# EAGLE schematic BC40M_nrf53 (EAGLE 9.6.2)

## Sheet 1 of 3
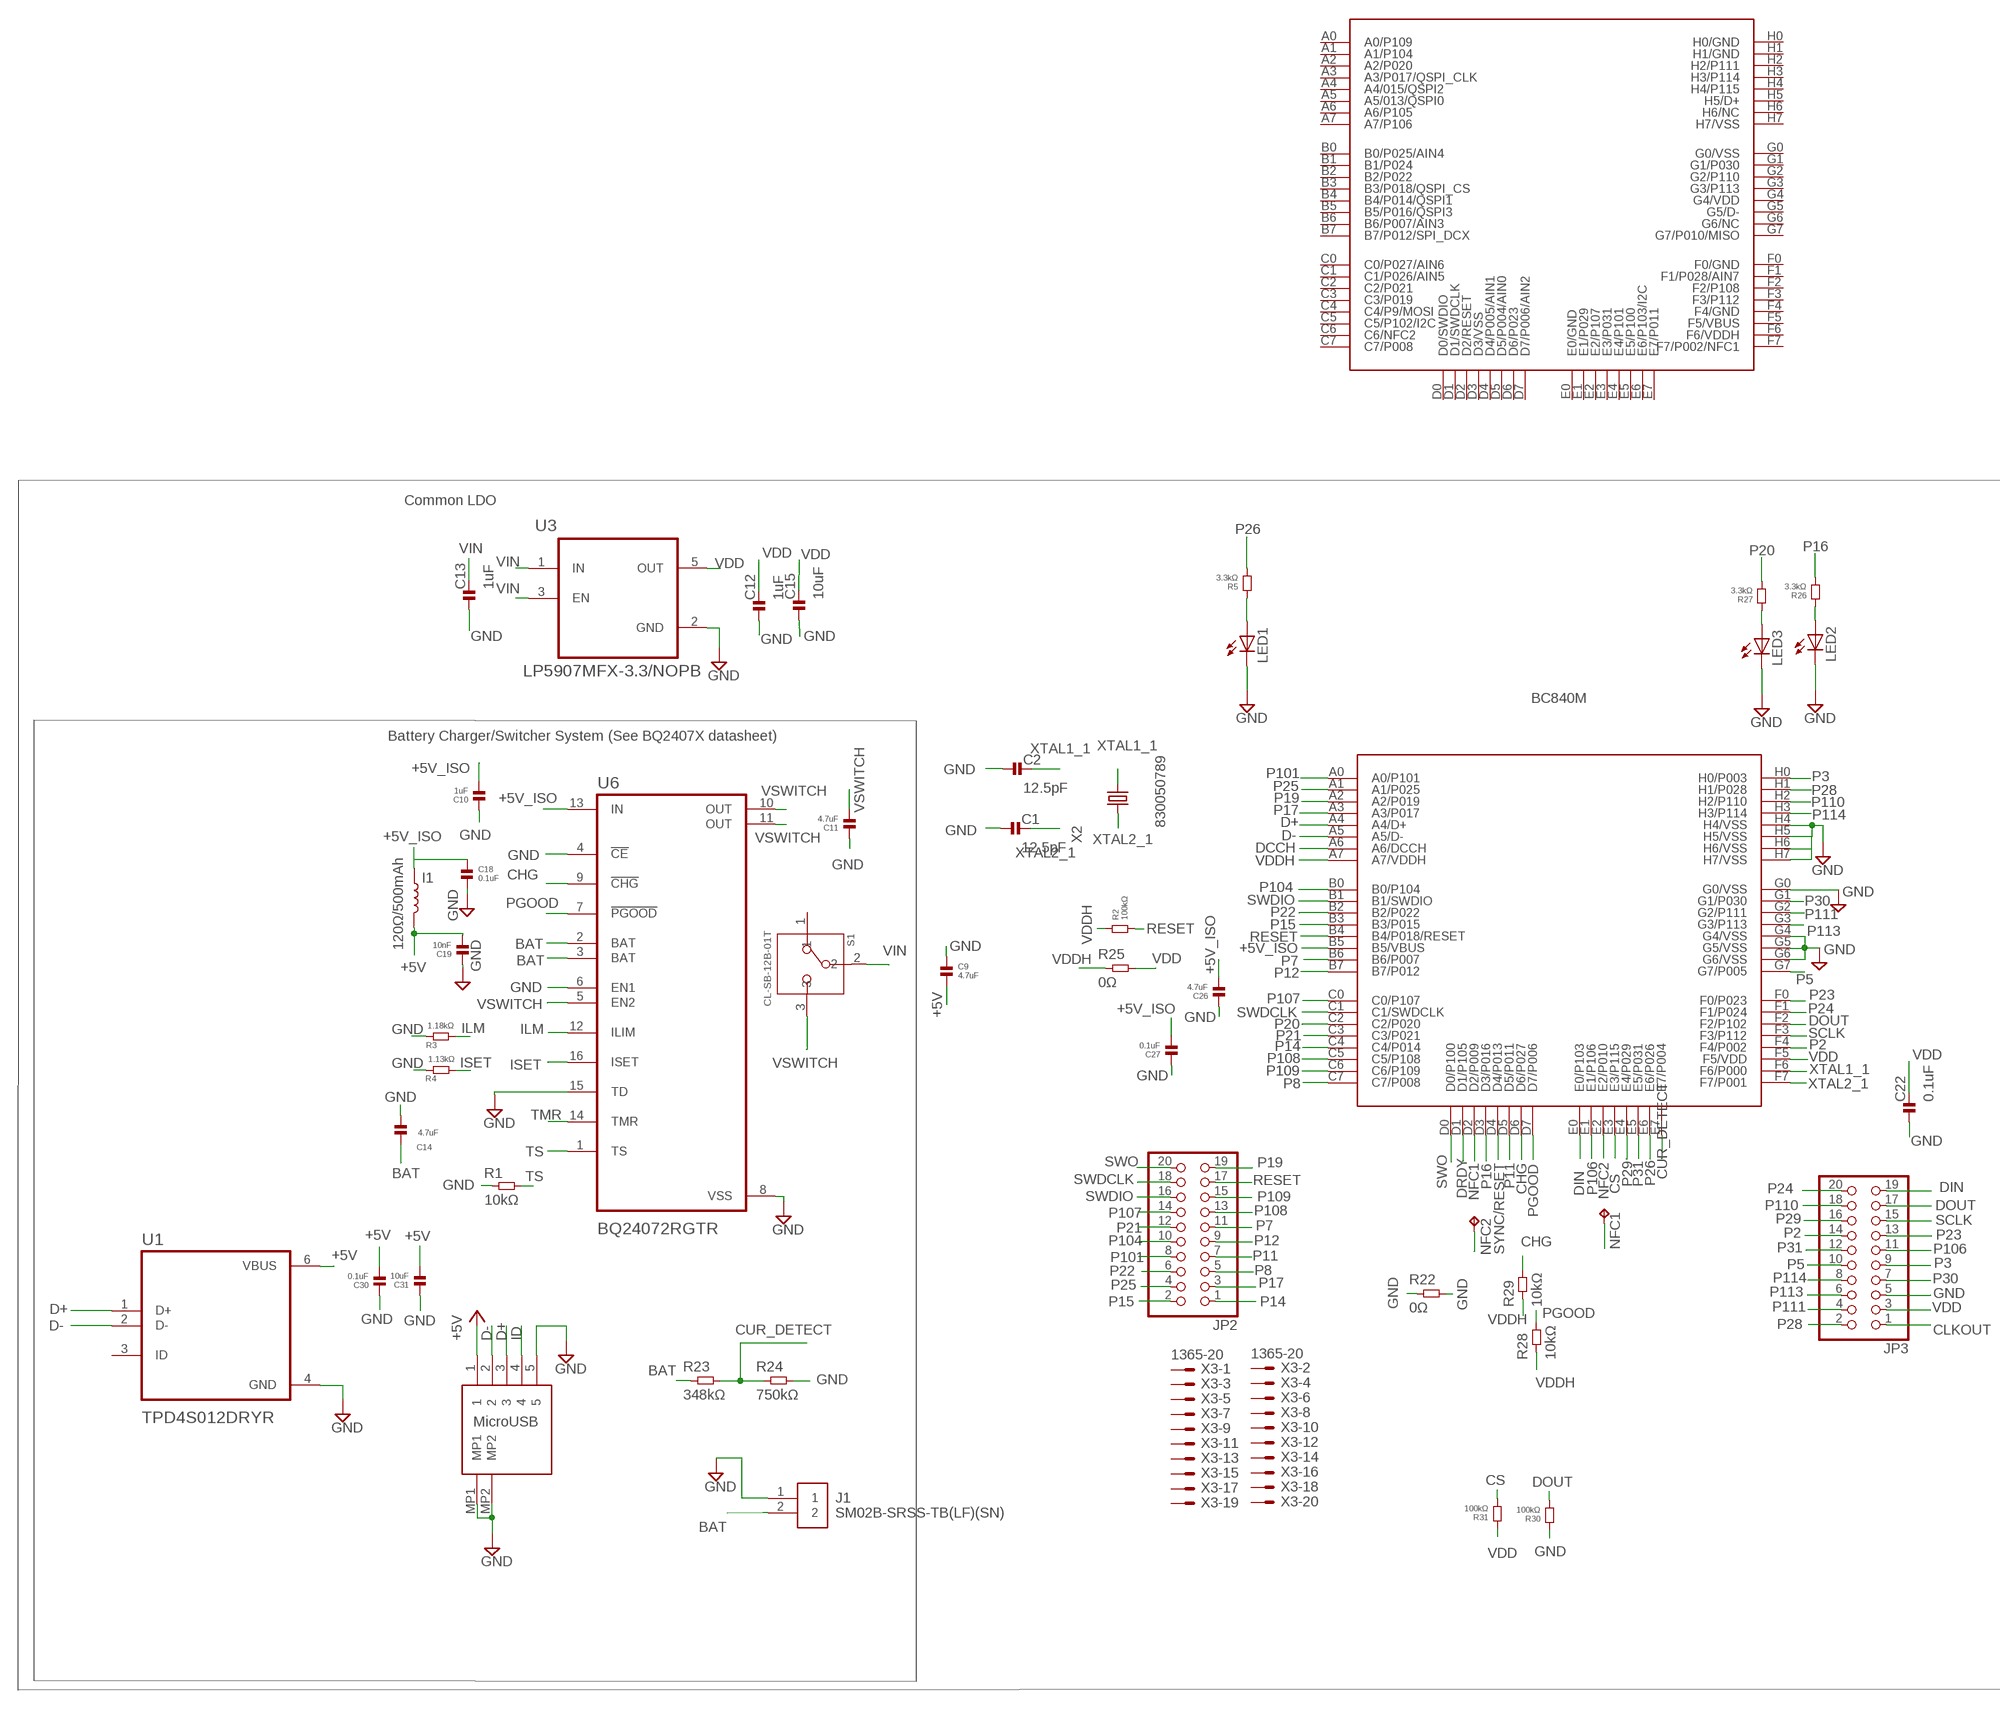
[diagram p0: schematic, sheet 1, part 1 of 2]
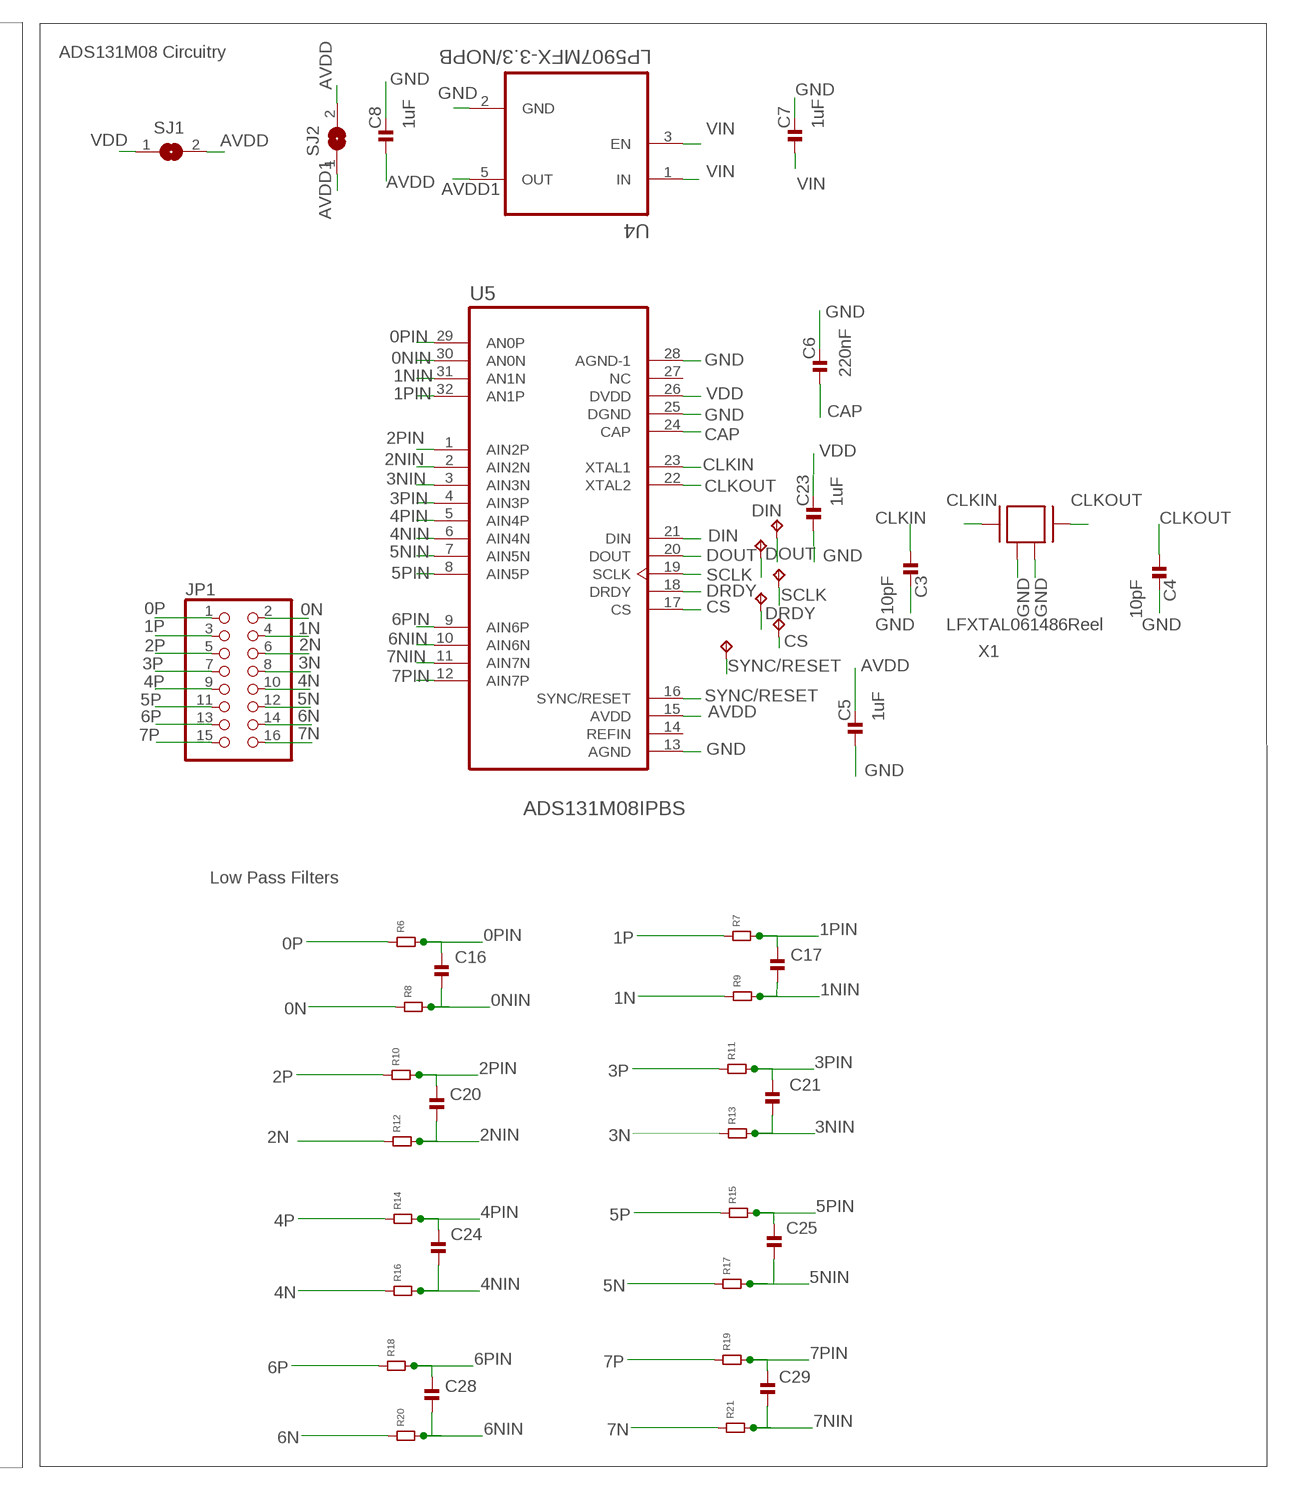
[diagram p1: schematic, sheet 1, part 2 of 2]

### Parts
C1  12.5pF  CAPACITOR.0201  [0201]
C2  12.5pF  CAPACITOR.0201  [0201]
C3  10pF  CAPACITOR.0201  [0201]
C4  10pF  CAPACITOR.0201  [0201]
C5  1uF  CAPACITOR.0201  [0201]
C6  220nF  CAPACITOR.0201  [0201]
C7  1uF  CAPACITOR.0201  [0201]
C8  1uF  CAPACITOR.0201  [0201]
C9  4.7uF  CAPACITOR.0201  [0201]
C10  1uF  CAPACITOR.0201  [0201]
C11  4.7uF  CAPACITOR.0201  [0201]
C12  1uF  CAPACITOR.0201  [0201]
C13  1uF  CAPACITOR.0201  [0201]
C14  4.7uF  CAPACITOR.0201  [0201]
C15  10uF  CAPACITOR.0402  [0402]
C16  100pF  CAPACITOR.0603  [0603]
C17  100pF  CAPACITOR.0603  [0603]
C18  0.1uF  CAPACITOR.0201  [0201]
C19  10nF  CAPACITOR.0201  [0201]
C20  100pF  CAPACITOR.0603  [0603]
C21  100pF  CAPACITOR.0603  [0603]
C22  0.1uF  CAPACITOR.0201  [0201]
C23  1uF  CAPACITOR.0201  [0201]
C24  100pF  CAPACITOR.0603  [0603]
C25  100pF  CAPACITOR.0603  [0603]
C26  4.7uF  CAPACITOR.0201  [0201]
C27  0.1uF  CAPACITOR.0201  [0201]
C28  100pF  CAPACITOR.0603  [0603]
C29  100pF  CAPACITOR.0603  [0603]
C30  0.1uF  CAPACITOR.0201  [0201]
C31  10uF  CAPACITOR.0402  [0402]
CS  TPTP07R  [TP07R]
DIN  TPTP07R  [TP07R]
DOUT  TPTP07R  [TP07R]
DRDY  TPTP07R  [TP07R]
I1  120Ω/500mAh  12NH-0402  [0402_COILCRAFT]
J1  SM02B-SRSS-TB(LF)(SN)  [SM02B-SRSS-TB(LF)(SN)]
JP1  PINHD-2X8SMT  [2X08_SMT]
JP2  PINHD-2X10SMT  [2X10_SMT]
JP3  PINHD-2X10SMT  [2X10_SMT]
LED1  LEDCHIPLED_0603  [CHIPLED_0603]
LED2  LEDCHIPLED_0603  [CHIPLED_0603]
LED3  LEDCHIPLED_0603  [CHIPLED_0603]
NFC1  TPTP14SQ  [TP14SQ]
NFC2  TPTP14SQ  [TP14SQ]
R1  10kΩ  RESISTOR.0201  [0201]
R2  100kΩ  RESISTOR.0201  [0201]
R3  1.18kΩ  RESISTOR.0603  [0603]
R4  1.13kΩ  RESISTOR.0603  [0603]
R5  3.3kΩ  RESISTOR.0201  [0201]
R6  1MOhm  RESISTOR.0603  [0603]
R7  1MOhm  RESISTOR.0603  [0603]
R8  1MOhm  RESISTOR.0603  [0603]
R9  1MOhm  RESISTOR.0603  [0603]
R10  1MOhm  RESISTOR.0603  [0603]
R11  1MOhm  RESISTOR.0603  [0603]
R12  1MOhm  RESISTOR.0603  [0603]
R13  1MOhm  RESISTOR.0603  [0603]
R14  1MOhm  RESISTOR.0603  [0603]
R15  1MOhm  RESISTOR.0603  [0603]
R16  1MOhm  RESISTOR.0603  [0603]
R17  1MOhm  RESISTOR.0603  [0603]
R18  1MOhm  RESISTOR.0603  [0603]
R19  1MOhm  RESISTOR.0603  [0603]
R20  1MOhm  RESISTOR.0603  [0603]
R21  1MOhm  RESISTOR.0603  [0603]
R22  0Ω  RESISTOR.0805  [0805]
R23  348kΩ  RESISTOR.0603  [0603]
R24  750kΩ  RESISTOR.0603  [0603]
R25  0Ω  RESISTOR.0805  [0805]
R26  3.3kΩ  RESISTOR.0201  [0201]
R27  3.3kΩ  RESISTOR.0201  [0201]
R28  10kΩ  RESISTOR.0402  [0402]
R29  10kΩ  RESISTOR.0402  [0402]
R30  100kΩ  RESISTOR.0402  [0402]
R31  100kΩ  RESISTOR.0402  [0402]
S1  CL-SB-12B-01T  [CL-SB-12B]
SCLK  TPTP07R  [TP07R]
SJ1  SJ  [SJ]
SJ2  SJ  [SJ]
SYNC  TPTP07R  [TP07R]
U1  TPD4S012DRYR  [PSON50P145X100X60-6N]
U2  BC840M  [BC840M]
U3  LP5907MFX-3.3/NOPB  [SOT95P280X145-5N]
U4  LP5907MFX-3.3/NOPB  [SOT95P280X145-5N]
U5  ADS131M08IPBS  [QFP50P700X700X120-32N]
U6  BQ24072RGTR  [QFN50P300X300X100-17N]
U7  DX4R005JJ2R1800  [DX4R005JJ2R1800]
U$1  BC40M  [BC40M]
X1  ABM3B-8.000MHZ-B2-T  [ABM3B-8.000MHZ-B2-T]
X2  FC-12M  [FC-12M]
X3  1365-20  [1365-20]

### Nets
0N: JP1.2 R8.1
0NIN: C16.2 R8.2 U5.30(AN0N)
0P: JP1.1 R6.1
0PIN: C16.1 R6.2 U5.29(AN0P)
1N: JP1.4 R9.1
1NIN: C17.2 R9.2 U5.31(AN1N)
1P: JP1.3 R7.1
1PIN: C17.1 R7.2 U5.32(AN1P)
2N: JP1.6 R12.1
2NIN: C20.2 R12.2 U5.2(AIN2N)
2P: JP1.5 R10.1
2PIN: C20.1 R10.2 U5.1(AIN2P)
3N: JP1.8 R13.1
3NIN: C21.2 R13.2 U5.3(AIN3N)
3P: JP1.7 R11.1
3PIN: C21.1 R11.2 U5.4(AIN3P)
4N: JP1.10 R16.1
4NIN: C24.2 R16.2 U5.6(AIN4N)
4P: JP1.9 R14.1
4PIN: C24.1 R14.2 U5.5(AIN4P)
5N: JP1.12 R17.1
5NIN: C25.2 R17.2 U5.7(AIN5N)
5P: JP1.11 R15.1
5PIN: C25.1 R15.2 U5.8(AIN5P)
6N: JP1.14 R20.1
6NIN: C28.2 R20.2 U5.10(AIN6N)
6P: JP1.13 R18.1
6PIN: C28.1 R18.2 U5.9(AIN6P)
7N: JP1.16 R21.1
7NIN: C29.2 R21.2 U5.11(AIN7N)
7P: JP1.15 R19.1
7PIN: C29.1 R19.2 U5.12(AIN7P)
+5V: C9.2 C19.2 C30.2 C31.2 I1.P$2 U1.6(VBUS) U7.1
+5V_ISO: C10.2 C18.1 C26.2 C27.2 I1.P$1 U2.B5(B5/VBUS) U6.13(IN)
AVDD: C5.2 C8.1 SJ1.2 SJ2.2 U5.15(AVDD)
AVDD1: SJ2.1 U4.5(OUT)
BAT: C14.2 J1.2 R23.1 U6.2(BAT) U6.3(BAT)
CAP: C6.1 U5.24(CAP)
CHG: R29.2 U2.D6(D6/P027) U6.9(!CHG)
CLKIN: C3.1 U5.23(XTAL1) X1.1
CLKOUT: C4.1 JP3.1 U5.22(XTAL2) X1.3
CS: CS.TP R31.1 U2.E3(E3/P115) U5.17(CS)
CUR_DETECT: R23.2 R24.1 U2.E7(E7/P004)
D+: U1.1(D+) U2.A4(A4/D+) U7.3
D-: U1.2(D-) U2.A5(A5/D-) U7.2
DCCH: U2.A6(A6/DCCH)
DIN: DIN.TP JP3.19 U2.E0(E0/P103) U5.21(DIN)
DOUT: DOUT.TP JP3.17 R30.1 U2.F2(F2/P102) U5.20(DOUT)
DRDY: DRDY.TP U2.D1(D1/P105) U5.18(DRDY)
GND: C1.1 C2.1 C3.2 C4.2 C5.1 C6.2 C7.2 C8.2 C9.1 C10.1 C11.1 C12.1 C13.1 C14.1 C15.1 C18.2 C19.1 C22.1 C23.1 C26.1 C27.1 C30.1 C31.1 J1.1 JP3.5 LED1.C LED2.C LED3.C R1.1 R3.1 R4.1 R22.1 R22.2 R24.2 R30.2 U1.4(GND) U2.G0(G0/VSS) U2.G4(G4/VSS) U2.G5(G5/VSS) U2.G6(G6/VSS) U2.H4(H4/VSS) U2.H5(H5/VSS) U2.H6(H6/VSS) U2.H7(H7/VSS) U3.2(GND) U4.2(GND) U5.13(AGND) U5.25(DGND) U5.28(AGND-1) U6.4(!CE) U6.6(EN1) U6.8(VSS) U6.15(TD) U7.5 U7.MP1 U7.MP2 X1.2 X1.4
ID: U7.4
ILM: R3.2 U6.12(ILIM)
ISET: R4.2 U6.16(ISET)
LED1: LED1.A R5.2
LED2: LED2.A R26.2
LED3: LED3.A R27.2
NFC1: NFC2.TP U2.D2(D2/P009)
NFC2: NFC1.TP U2.E2(E2/P010)
P2: JP3.14 U2.F4(F4/P002)
P3: JP3.9 U2.H0(H0/P003)
P5: JP3.10 U2.G7(G7/P005)
P7: JP2.11 U2.B6(B6/P007)
P8: JP2.5 U2.C7(C7/P008)
P11: JP2.7 U2.D5(D5/P011)
P12: JP2.9 U2.B7(B7/P012)
P14: JP2.1 U2.C4(C4/P014)
P15: JP2.2 U2.B3(B3/P015)
P16: R26.1 U2.D3(D3/P016)
P17: JP2.3 U2.A3(A3/P017)
P19: JP2.19 U2.A2(A2/P019)
P20: R27.1 U2.C2(C2/P020)
P21: JP2.12 U2.C3(C3/P021)
P22: JP2.6 U2.B2(B2/P022)
P23: JP3.13 U2.F0(F0/P023)
P24: JP3.20 U2.F1(F1/P024)
P25: JP2.4 U2.A1(A1/P025)
P26: R5.1 U2.E6(E6/P026)
P28: JP3.2 U2.H1(H1/P028)
P29: JP3.16 U2.E4(E4/P029)
P30: JP3.7 U2.G1(G1/P030)
P31: JP3.12 U2.E5(E5/P031)
P101: JP2.8 U2.A0(A0/P101)
P104: JP2.10 U2.B0(B0/P104)
P106: JP3.11 U2.E1(E1/P106)
P107: JP2.14 U2.C0(C0/P107)
P108: JP2.13 U2.C5(C5/P108)
P109: JP2.15 U2.C6(C6/P109)
P110: JP3.18 U2.H2(H2/P110)
P111: JP3.4 U2.G2(G2/P111)
P113: JP3.6 U2.G3(G3/P113)
P114: JP3.8 U2.H3(H3/P114)
PGOOD: R28.2 U2.D7(D7/P006) U6.7(!PGOOD)
RESET: JP2.17 R2.1 U2.B4(B4/P018/RESET)
SCLK: JP3.15 SCLK.TP U2.F3(F3/P112) U5.19(SCLK)
SWDCLK: JP2.18 U2.C1(C1/SWDCLK)
SWDIO: JP2.16 U2.B1(B1/SWDIO)
SWO: JP2.20 U2.D0(D0/P100)
SYNC/RESET: SYNC.TP U2.D4(D4/P013) U5.16(SYNC/RESET)
TMR: U6.14(TMR)
TS: R1.2 U6.1(TS)
VDD: C12.2 C15.2 C22.2 C23.2 JP3.3 R25.2 R31.2 SJ1.1 U2.F5(F5/VDD) U3.5(OUT) U5.26(DVDD)
VDDH: R2.2 R25.1 R28.1 R29.1 U2.A7(A7/VDDH)
VIN: C7.1 C13.2 S1.2 U3.1(IN) U3.3(EN) U4.1(IN) U4.3(EN)
VSWITCH: C11.2 S1.3 U6.5(EN2) U6.10(OUT) U6.11(OUT)
XTAL1_1: C2.2 U2.F6(F6/P000) X2.2
XTAL2_1: C1.2 U2.F7(F7/P001) X2.1
Unconnected: S1.1 U1.3(ID) U5.14(REFIN) U5.27(NC) U$1.A0(A0/P109) U$1.A1(A1/P104) U$1.A2(A2/P020) U$1.A3(A3/P017/QSPI_CLK) U$1.A4(A4/015/QSPI2) U$1.A5(A5/013/QSPI0) U$1.A6(A6/P105) U$1.A7(A7/P106) U$1.B0(B0/P025/AIN4) U$1.B1(B1/P024) U$1.B2(B2/P022) U$1.B3(B3/P018/QSPI_CS) U$1.B4(B4/P014/QSPI1) U$1.B5(B5/P016/QSPI3) U$1.B6(B6/P007/AIN3) U$1.B7(B7/P012/SPI_DCX) U$1.C0(C0/P027/AIN6) U$1.C1(C1/P026/AIN5) U$1.C2(C2/P021) U$1.C3(C3/P019) U$1.C4(C4/P9/MOSI) U$1.C5(C5/P102/I2C) U$1.C6(C6/NFC2) U$1.C7(C7/P008) U$1.D0(D0/SWDIO) U$1.D1(D1/SWDCLK) U$1.D2(D2/RESET) U$1.D3(D3/VSS) U$1.D4(D4/P005/AIN1) U$1.D5(D5/P004/AIN0) U$1.D6(D6/P023) U$1.D7(D7/P006/AIN2) U$1.E0(E0/GND) U$1.E1(E1/P029) U$1.E2(E2/P107) U$1.E3(E3/P031) U$1.E4(E4/P101) U$1.E5(E5/P100) U$1.E6(E6/P103/I2C) U$1.E7(E7/P011) U$1.F0(F0/GND) U$1.F1(F1/P028/AIN7) U$1.F2(F2/P108) U$1.F3(F3/P112) U$1.F4(F4/GND) U$1.F5(F5/VBUS) U$1.F6(F6/VDDH) U$1.F7(F7/P002/NFC1) U$1.G0(G0/VSS) U$1.G1(G1/P030) U$1.G2(G2/P110) U$1.G3(G3/P113) U$1.G4(G4/VDD) U$1.G5(G5/D-) U$1.G6(G6/NC) U$1.G7(G7/P010/MISO) U$1.H0(H0/GND) U$1.H1(H1/GND) U$1.H2(H2/P111) U$1.H3(H3/P114) U$1.H4(H4/P115) U$1.H5(H5/D+) U$1.H6(H6/NC) U$1.H7(H7/VSS) X3.1 X3.2 X3.3 X3.4 X3.5 X3.6 X3.7 X3.8 X3.9 X3.10 X3.11 X3.12 X3.13 X3.14 X3.15 X3.16 X3.17 X3.18 X3.19 X3.20

### Notes on the sheet
- Common LDO
- ADS131M08 Circuitry
- BC840M
- Battery Charger/Switcher System (See BQ2407X datasheet)
- 830050789
- LFXTAL061486Reel
- Low Pass Filters
- MicroUSB

## Sheet 2 of 3

## Sheet 3 of 3

## Library data of the parts
C1-C31 = standardparts:CAPACITOR
CS DIN DOUT DRDY NFC1 NFC2 SCLK SYNC = testpad:TP: Test pad
I1 = spkfncoils:12NH; MOUSER_PART: 994-0402HP-12NXGLU; PROD_ID: NDUC-15271; VALUE: 12nH
J1 = SM02B-SRSS-TB_LF__SN_:SM02B-SRSS-TB(LF)(SN): JST (JAPAN SOLDERLESS TERMINALS) - SM02B-SRSS-TB (LF)(SN) - HEADER, R/A, 2WAY Source: Datasheet <http://www.jst-mfg.com/product/pdf/eng/eSH.pdf> Check prices <https://pricing.snapeda.com/parts/SM02B-SRSS-TB%28LF%29%28SN%29/JST%20Sales/view-part?ref=eda>; AVAILABILITY: In Stock; DESCRIPTION: Connector Header Surface Mount, Right Angle 2 position 0.039 (1.00mm); MF: JST Sales; MP: SM02B-SRSS-TB(LF)(SN); PACKAGE: None; PRICE: None
JP1 = pinhead+:PINHD-2X8: PIN HEADER
JP2 JP3 = pinhead+:PINHD-2X10: PIN HEADER
LED1-LED3 = adafruit:LED: LED OSRAM: - CHIPLED LG R971, LG N971, LY N971, LG Q971, LY Q971, LO R971, LY R971 LH N974, LH R974 LS Q976, LO Q976, LY Q976 LO Q996 - Hyper CHIPLED LW Q18S LB Q993, LB Q99A, LB R99A - SideLED LS A670, LO A670, LY A670, LG A670, LP A670 LB A673, LV A673, LT A673, LW A673 LH A674 LY A675 LS A676, LA A676, LO A676, LY A676, LW A676 LS A679, LY A679, LG A679 - Hyper Micro SIDELED® LS Y876, LA Y876, LO Y876, LY Y876 LT Y87S - SmartLED LW L88C, LW L88S LB L89C, LB L89S, LG L890 LS L89K, LO L89K, LY L89K LS L896, LA L896, LO L896, LY L896 - TOPLED LS T670, LO T670, LY T670, LG T670, LP T670 LSG T670, LSP T670, LSY T670, LOP T670, LYG T670 LG T671, LOG T671, LSG T671 LB T673, LV T673, LT T673, LW T673 LH T674 LS T676, LA T676, LO T676, LY T676, LB T676, LH T676, LSB T676, LW T676 LB T67C, LV T67C, LT T67C, LS T67K, LO T67K, LY T67K, LW E67C LS E67B, LA E67B, LO E67B, LY E67B, LB E67C, LV E67C, LT E67C LW T67C LS T679, LY T679, LG T679 LS T770, LO T770, LY T770, LG T770, LP T770 LB T773, LV T773, LT T773, LW T773 LH T774 LS E675, LA E675, LY E675, LS T675 LS T776, LA T776, LO T776, LY T776, LB T776 LHGB T686 LT T68C, LB T68C - Hyper Mini TOPLED® LB M676 - Mini TOPLED Santana® LG M470 LS M47K, LO M47K, LY M47K Source: http://www.osram.convergy.de/
R1 R2 R4-R31 = standardparts:RESISTOR
R3 = standardparts:RESISTOR; SPICEPREFIX: R
S1 = CL-SB-12B-01T:CL-SB-12B-01T: Check prices <https://pricing.snapeda.com/parts/CL-SB-12B-01T/Nidec%20Copal/view-part?ref=eda>; AVAILABILITY: In Stock; DESCRIPTION: Slide Switch SPDT Surface Mount; MF: Nidec Copal; MP: CL-SB-12B-01T; PACKAGE: None; PRICE: None
SJ1 SJ2 = jumper:SJ: SMD solder JUMPER
U1 = TPD4S012DRYR:TPD4S012DRYR: Check prices <https://pricing.snapeda.com/parts/TPD4S012DRYR/Texas%20Instruments/view-part?ref=eda>; AVAILABILITY: In Stock; DESCRIPTION: 4-channel USB ESD solution with power clamp 6-SON -40 to 85; MF: Texas Instruments; MP: TPD4S012DRYR; PACKAGE: USON-6 Texas Instruments; PRICE: None; PURCHASE-URL: https://pricing.snapeda.com/search/part/TPD4S012DRYR/?ref=eda
U2 = BC840M:BC840M: Check prices <https://pricing.snapeda.com/parts/BC840M/Fanstel%20Corp./view-part?ref=eda>; AVAILABILITY: In Stock; DESCRIPTION: 802.15.4, Bluetooth Bluetooth v5.0, Thread, Zigbee® Transceiver Module 2.4GHz PCB Trace Surface Mount; MF: Fanstel Corp.; MP: BC840M; PACKAGE: None; PRICE: None; PURCHASE-URL: https://pricing.snapeda.com/search/part/BC840M/?ref=eda
U3 U4 = LP5907MFX-3.3_NOPB:LP5907MFX-3.3/NOPB: IC REG LINEAR 3.3V 250MA SOT23; AVAILABILITY: Unavailable; DESCRIPTION: Linear Voltage Regulator IC 1 Output 250mA SOT-23-5; MF: Texas Instruments; MP: LP5907MFX-3.3/NOPB; PACKAGE: SOT-23 Texas Instruments; PRICE: None
U5 = ADS131M08IPBS:ADS131M08IPBS: None Check prices <https://pricing.snapeda.com/parts/ADS131M08IPBS/Texas%20Instruments/view-part?ref=eda>; AVAILABILITY: Warning; DESCRIPTION: 24-bit 32-kSPS 8-channelsimultaneous-sampling delta-sigma ADC 32-TQFP -40 to 125; MF: Texas Instruments; MP: ADS131M08IPBS; PACKAGE: TQFP-32 Texas Instruments; PRICE: None; PURCHASE-URL: https://pricing.snapeda.com/search/part/ADS131M08IPBS/?ref=eda
U6 = BQ24072RGTR:BQ24072RGTR: Check prices <https://pricing.snapeda.com/parts/BQ24072RGTR/Texas%20Instruments/view-part?ref=eda>; AVAILABILITY: In Stock; DESCRIPTION: Standalone 1-cell 1.5-A linear charger, Power Path, 4.2-V VBAT and VOUT=VBAT + 225mV 16-VQFN -40 to 85; MF: Texas Instruments; MP: BQ24072RGTR; PACKAGE: VQFN-16 Texas Instruments; PRICE: None; PURCHASE-URL: https://pricing.snapeda.com/search/part/BQ24072RGTR/?ref=eda
U7 = DX4R005JJ2R1800:DX4R005JJ2R1800: Check prices <https://pricing.snapeda.com/parts/DX4R005JJ2R1800/JAE%20Electronics/view-part?ref=eda>; AVAILABILITY: In Stock; DESCRIPTION: USB - micro B USB 2.0 Receptacle Connector 5 Position Surface Mount, Right Angle; Through Hole; MF: JAE Electronics; MP: DX4R005JJ2R1800; PACKAGE: None; PRICE: None
U$1 = BC40M-V0-lib2:BC40M
X1 = Crystals_Oscillators:ABM3B-8.000MHZ-B2-T: CRYSTAL 8.0000MHZ 18PF SMD Manufacturer's datasheet <https://abracon.com/Resonators/abm3b.pdf>; CREATED_BY: PCBLayout.com; DIGIKEY_PART_NUMBER: 535-9720-2-ND; MANUFACTURER: Abracon LLC; MPN: ABM3B-8.000MHZ-B2-T; PACKAGE: SMD 4
X2 = crystal:FC-12M: kHz RANGE CRYSTAL UNIT LOW PROFILE SMD Source: Epson Toyocom FC-12M.pdf
X3 = con-leotronics:1365-20: DUAL ROW STRAIGHT HEADER 1364 SERIES. 1.27mm x 1.27mm. Without Fixing Post. SMT Source: http://www.leotronics.co.uk/Conexcon/Data%20Sheets/sec.%20A/1364ing.pdf; OC_FARNELL: unknown; OC_NEWARK: unknown